# Altium project Wenzel_REF.PrjPCB (part 7 of 7)

## Sheet Wenzel_Arduino.SchDoc: =SheetTitle_Top
size 420 x 297 mm; EDA_Number: ARTIQ; Projet: Wenzel; Author: G.Kasprowicz; CompanyName: WUT ISE; DrawnBy: G.Kasprowicz; Organization: WUT ISE; Address1: PW ISE; Address2: Nowowiejska 15/19 00-665 Warsaw; Address3: gkasprow@gmail.com; Revision: 1.1; SheetNumber: -; SheetTotal: -; ModifiedBy: -; CheckedDate: -; Title2: Arduino; DivGrp: WUT ISE; Designer: G.Kasprowicz; ModifiedDate: -; ProjectName: Sensor Box
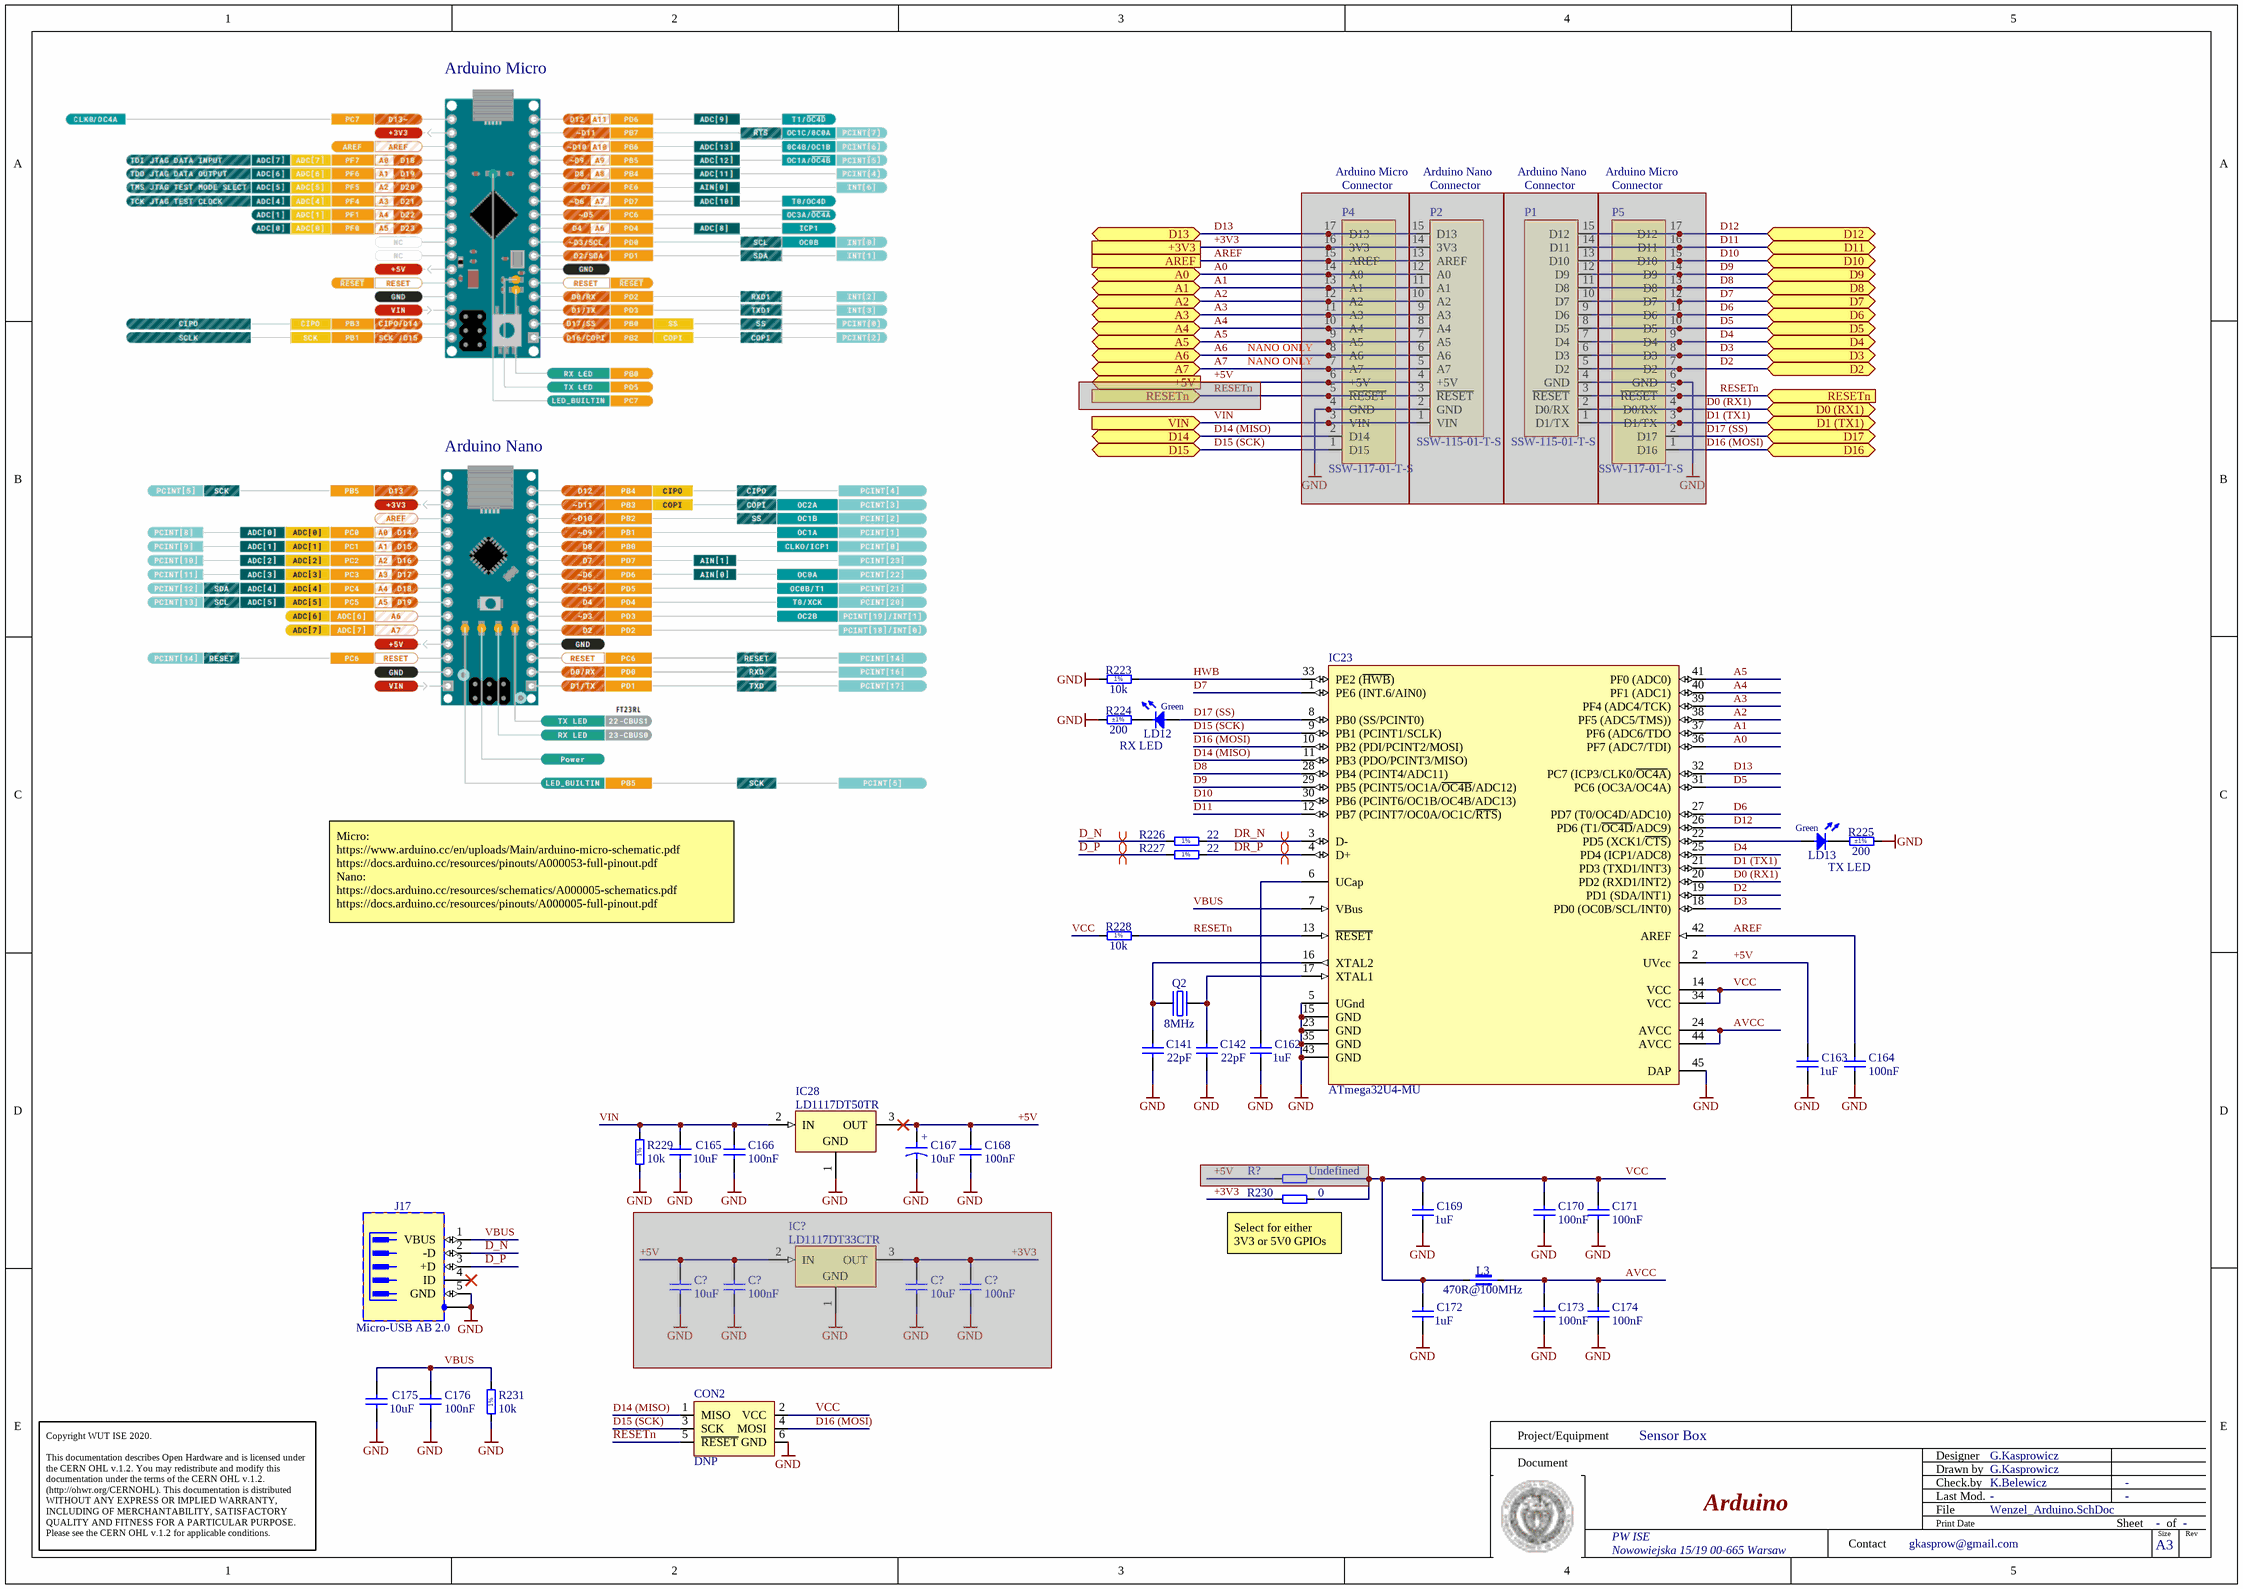
[diagram p10: Wenzel_Arduino.SchDoc]

### Parts
(Parts that share a designator on the sheet are numbered #1, #2 ... from top to bottom, then left to right.)
C141#2  22pF  [CAPC1005X55N]
C142#2  22pF  [CAPC1005X55N]
C162  1uF  [CAPC1005X55N]
C163  1uF  [CAPC1005X55N]
C164  100nF  [CAPC1005X55N]
C165  10uF  [CAPC1608X80N]
C166  100nF  [CAPC1005X55N]
C167  10uF  [CAPMP3216X180N]
C168  100nF  [CAPC1005X55N]
C169  1uF  [CAPC1005X55N]
C170  100nF  [CAPC1005X55N]
C171  100nF  [CAPC1005X55N]
C172  1uF  [CAPC1005X55N]
C173  100nF  [CAPC1005X55N]
C174  100nF  [CAPC1005X55N]
C175  10uF  [CAPC1608X80N]
C176  100nF  [CAPC1005X55N]
C?#5  100nF  [CAPC1608X87N]  (masked out: inside a compile mask, not in the netlist)
C?#6  100nF  [CAPC1608X87N]  (masked out: inside a compile mask, not in the netlist)
C?#7  10uF  [CAPC1608X80N]  (masked out: inside a compile mask, not in the netlist)
C?#8  10uF  [CAPC1608X80N]  (masked out: inside a compile mask, not in the netlist)
CON2  DNP  [HEADER3x2]
IC23#2  ATmega32U4-MU  [44PW_M]
IC28  LD1117DT50TR  [TO228P972X240-3N-R540X510]
IC?  LD1117DT33CTR  [TO228P972X240-3N-R540X510]  (masked out: inside a compile mask, not in the netlist)
J17  Micro-USB AB 2.0  [HIROSE_ZX62RD-AB-5P8]
L3#2  470R@100MHz  [INDC1608X95N]
LD12  Green  [LED_KINGBRIGHT_KPH-1608CGCK]
LD13  Green  [LED_KINGBRIGHT_KPH-1608CGCK]
P1  SSW-115-01-T-S  [SSW-115-01-T-S]  (masked out: inside a compile mask, not in the netlist)
P2  SSW-115-01-T-S  [SSW-115-01-T-S]  (masked out: inside a compile mask, not in the netlist)
P4  SSW-117-01-T-S  [SSW-117-01-T-S]  (masked out: inside a compile mask, not in the netlist)
P5  SSW-117-01-T-S  [SSW-117-01-T-S]  (masked out: inside a compile mask, not in the netlist)
Q2  8MHz  [XTAL_TXC_7A]
R223  10k  [RESC1608X55N]
R224  200  Tolerance: ±1%  [RESC1005X40N]
R225  200  Tolerance: ±1%  [RESC1005X40N]
R226  22  [RESC1005X40N]
R227  22  [RESC1005X40N]
R228  10k  [RESC1608X55N]
R229  10k  [RESC1608X55N]
R230  0  [RESC1005X40N]
R231  10k  [RESC1608X55N]
R?#4  Undefined  [RESC1005X40N]  (masked out: inside a compile mask, not in the netlist)

### Ports
+3V3, +5V (out), A0 (bidir), A1 (bidir), A2 (bidir), A3 (bidir), A4 (bidir), A5 (bidir), A6 (bidir), A7 (bidir), AREF, D0 (RX1) (bidir), D1 (TX1) (bidir), D2 (bidir), D3 (bidir), D4 (bidir), D5 (bidir), D6 (bidir), D7 (bidir), D8 (bidir), D9 (bidir), D10 (bidir), D11 (bidir), D12 (bidir), D13 (bidir), D14 (bidir), D15 (bidir), D16 (bidir), D17 (bidir), RESETn (in), VIN (in)

### Nets
+3V3: R230.2 ; port +3V3  [project net P3V3]
GND: C141#2.1 C142#2.1 C162.1 C163.1 C164.1 C165.1 C166.1 C167.2 C168.1 C169.1 C170.1 C171.1 C172.1 C173.1 C174.1 C175.1 C176.1 CON2.6(GND) IC23#2.5(UGnd) IC23#2.15(GND) IC23#2.23(GND) IC23#2.35(GND) IC23#2.43(GND) IC23#2.45(DAP) IC28.1(GND) J17.5(GND) J17.6(SH) R223.1 R224.1 R225.2 R229.1 R231.1
VIN: C165.2 C166.2 IC28.2(IN) R229.2 ; port VIN  [project net P12V0]
+5V: C163.2 C167.1 C168.2 IC23#2.2(UVcc) IC28.3(OUT)
A0: IC23#2.36(PF7_(ADC7/TDI)) ; port A0
A1: IC23#2.37(PF6_(ADC6/TDO) ; port A1
A2: IC23#2.38(PF5_(ADC5/TMS))) ; port A2
A3: IC23#2.39(PF4_(ADC4/TCK)) ; port A3
A4: IC23#2.40(PF1_(ADC1)) ; port A4
A5: IC23#2.41(PF0_(ADC0)) ; port A5
A6: port A6
A7: port A7
AREF: C164.2 IC23#2.42(AREF) ; port AREF
AVCC: C173.2 C174.2 IC23#2.24(AVCC) IC23#2.44(AVCC) L3#2.2
D0 (RX1): IC23#2.20(PD2_(RXD1/INT2))
D1 (TX1): IC23#2.21(PD3_(TXD1/INT3))
D2: IC23#2.19(PD1_(SDA/INT1)) ; port D2
D3: IC23#2.18(PD0_(OC0B/SCL/INT0)) ; port D3
D4: IC23#2.25(PD4_(ICP1/ADC8)) ; port D4
D5: IC23#2.31(PC6_(OC3A/OC4A)) ; port D5
D6: IC23#2.27(PD7_(T0/OC4D/ADC10)) ; port D6
D7: IC23#2.1(PE6_(INT.6/AIN0)) ; port D7
D8: IC23#2.28(PB4_(PCINT4/ADC11)) ; port D8
D9: IC23#2.29(PB5_(PCINT5/OC1A/~{OC4B}/ADC12)) ; port D9
D10: IC23#2.30(PB6_(PCINT6/OC1B/OC4B/ADC13)) ; port D10
D11: IC23#2.12(PB7_(PCINT7/OC0A/OC1C/~{RTS})) ; port D11
D12: IC23#2.26(PD6_(T1/~{OC4D}/ADC9)) ; port D12
D13: IC23#2.32(PC7_(ICP3/CLK0/~{OC4A})) ; port D13
D14 (MISO): CON2.1(MISO) IC23#2.11(PB3_(PDO/PCINT3/MISO)) ; port D14
D15 (SCK): CON2.3(SCK) IC23#2.9(PB1_(PCINT1/SCLK)) ; port D15
D16 (MOSI): CON2.4(MOSI) IC23#2.10(PB2_(PDI/PCINT2/MOSI))
D17 (SS): IC23#2.8(PB0_(SS/PCINT0)) LD12.2(A)
D_N: J17.2(-D) R226.1
D_P: J17.3(+D) R227.1
DR_N: IC23#2.3(D-) R226.2
DR_P: IC23#2.4(D+) R227.2
HWB: IC23#2.33(PE2_(~{HWB})) R223.2
RESETn: CON2.5(~{RESET}) IC23#2.13(~{RESET}) R228.2 ; port RESETn
VBUS: C175.2 C176.2 IC23#2.7(VBus) J17.1(VBUS) R231.2
VCC: C169.2 C170.2 C171.2 C172.2 CON2.2(VCC) IC23#2.14(VCC) IC23#2.34(VCC) L3#2.1 R228.1 R230.1
NetC141#2_2: C141#2.2 IC23#2.16(XTAL2) Q2.1(OSC1)
NetC142#2_2: C142#2.2 IC23#2.17(XTAL1) Q2.2(OSC2)
NetC162_2: C162.2 IC23#2.6(UCap)
NetIC23#2_22: IC23#2.22(PD5_(XCK1/~{CTS})) LD13.2(A)
NetLD12_1: LD12.1(C) R224.2
NetLD13_1: LD13.1(C) R225.1

Not connected (* = marked no-connect by the designer): J17 4(ID)*

### Layout directives
differential pair: D_N, D_P, DR_N, DR_P

### Notes on the sheet
- Arduino Micro
- Connector
- Arduino Nano
- (near P2) Connector
- (near P1) Connector
- (near P4) NANO ONLY
- RX LED
- Micro:
  https://www.arduino.cc/en/uploads/Main/arduino-micro-schematic.pdf
  https://docs.arduino.cc/resources/pinouts/A000053-full-pinout.pdf
  Nano:
  https://docs.arduino.cc/resources/schematics/A000005-schematics.pdf
  https://docs.arduino.cc/resources/pinouts/A000005-full-pinout.pdf
- TX LED
- (near R230) Select for either 3V3 or 5V0 GPIOs
- Project/Equipment
- Document
- Designer
- Drawn by
- Check.by
- Copyright WUT ISE 2020.
  This documentation describes Open Hardware and is licensed under the CERN OHL v.1.2. You may redistribute and modify this documentation under the terms of the CERN OHL v.1.2. (http://ohwr.org/CERNOHL). This documentation is distributed WITHOUT ANY EXPRESS OR IMPLIED WARRANTY, INCLUDING OF MERCHANTABILITY, SATISFACTORY QUALITY AND FITNESS FOR A PARTICULAR PURPOSE. Please see the CERN OHL v.1.2 for applicable conditions.
- Contact
- File
- Last Mod.
- Print Date
- Sheet
- Size
- A3
- of
- Rev
- (in symbol CTE3216-18_10UF_16V_20%_AVX_TCJ) +
- (in symbol R0402_22R_1%_0.0625W_100PPM) 1%
- (in symbol R0603_10K_1%_0.1W_100PPM) 1%

### Library data of the parts
C141#2 C142#2 = CC0402_22PF_50V_5%_C0G: Non-polarised capacitor; Part Description: SMD Multilayer Chip Ceramic Capacitor; Manufacturer: GENERIC; Manufacturer1 Part Number: C0402C220J5GACTU; Voltage: 50V; TC: C0G/NP0; Tolerance: ±5%; Part Number: CC0402_22PF_50V_5%_C0G; Component Kind: Standard; Component Type: Standard; Pin Count: 2; Value: 22pF; Status: Preferred; Manufacturer Part Number: CC0402_22PF_50V_5%_C0G; Case: 0402; Mounted: Yes; Socket: No; SMD: Yes; Manufacturer1 Example: KEMET; Manufacturer1 ComponentHeight: 0.55mm; HelpURL: \\cern.ch\dfs\Applications\Altium\Datasheets\CC0402_C0G_KEMET_(Commercial Grade).pdf; Author: CERN DEM JLC; CreateDate: 2007-12-03; LatestRevisionDate: 2007-12-03; Sense: No
C162 C163 C169 C172 = CC0402_1UF_16V_10%_X5R: Non-polarised capacitor; Part Description: SMD Multilayer Chip Ceramic Capacitor; Manufacturer: GENERIC; Manufacturer1 Part Number: C1005X5R1C105KT; Voltage: 16V; TC: X5R; Tolerance: ±10%; Part Number: CC0402_1UF_16V_10%_X5R; Component Kind: Standard; Component Type: Standard; Pin Count: 2; Value: 1uF; Status: Preferred; Manufacturer Part Number: CC0402_1UF_16V_10%_X5R; Case: 0402; Mounted: Yes; Socket: No; SMD: Yes; Sense: No; Manufacturer1 Example: TDK; Manufacturer1 ComponentHeight: 0.55mm; HelpURL: \\cern.ch\dfs\Applications\Altium\Datasheets\CC0402_X5R_TDK_C.pdf; Author: CERN DEM JLC; CreateDate: 2012-10-25; LatestRevisionDate: 2012-10-25
C164 C166 C168 C170 C171 C173 C174 C176 = CC0402_100NF_16V_10%_X5R: Non-polarised capacitor; Part Description: SMD Multilayer Chip Ceramic Capacitor; Manufacturer: GENERIC; Manufacturer1 Part Number: GRM155R61C104KA88D; Voltage: 16V; TC: X5R; Tolerance: ±10%; Part Number: CC0402_100NF_16V_10%_X5R; Component Kind: Standard; Component Type: Standard; Pin Count: 2; Value: 100nF; Status: None; Manufacturer Part Number: CC0402_100NF_16V_10%_X5R; Case: 0402; Mounted: Yes; Socket: No; SMD: Yes; Sense: No; Manufacturer1 Example: MURATA; Manufacturer1 ComponentHeight: 0.55mm; HelpURL: \\cern.ch\dfs\Applications\Altium\Datasheets\CC0402_X5R_MURATA_GRM.pdf; Author: CERN DEM JLC; CreateDate: 10.12.2013; LatestRevisionDate: 10.12.2013
C165 C175 = CC0603_10UF_16V_20%_X5R: Non-polarised capacitor; Part Description: SMD Multilayer Chip Ceramic Capacitor; Manufacturer: GENERIC; Manufacturer1 Part Number: GRM188R61C106MA73D; Voltage: 16V; TC: X5R; Tolerance: ±20%; Part Number: CC0603_10UF_16V_20%_X5R; Component Kind: Standard; Component Type: Standard; Pin Count: 2; Value: 10uF; Status: None; Manufacturer Part Number: CC0603_10UF_16V_20%_X5R; Case: 0603; Mounted: Yes; Socket: No; SMD: Yes; Sense: No; Manufacturer1 Example: MURATA; Manufacturer1 ComponentHeight: 0.8mm; HelpURL: \\cern.ch\dfs\Applications\Altium\Datasheets\CC0603_X5R_MURATA_GRM.pdf; Author: CERN DEM MR; CreateDate: 02.03.2016; LatestRevisionDate: 02.03.2016
C167 = CTE3216-18_10UF_16V_20%_AVX_TCJ: Polarised capacitor; Part Description: ESR 0R200 Tantalum Solid Electrolytic Chip Capacitor with Conductive Polymer Electrode; Manufacturer: AVX; Manufacturer Part Number: TCJA106M016R0200 or  or TR3A106K016C1700; Voltage: 16V; Tolerance: ±20%; Part Number: CTE3216-18_10UF_16V_20%_AVX_TCJ; Component Kind: Standard; Component Type: Standard; Pin Count: 2; Value: 10uF; Status: Preferred; Case: A; Mounted: Yes; Socket: No; SMD: Yes; Sense: No; HelpURL: \\cern.ch\dfs\Applications\Altium\Datasheets\CTE_AVX_TCJ.pdf; Author: CERN DEM JLC; CreateDate: 29.03.2012; LatestRevisionDate: 29.03.2012; ComponentHeight: 1.8mm
C?#5 C?#6 = CC0603_100NF_50V_10%_X5R: Non-polarised capacitor; Part Description: SMD Multilayer Chip Ceramic Capacitor; Manufacturer: GENERIC; Manufacturer1 Part Number: C1608X5R1H104K080AA; Voltage: 50V; TC: X5R; Tolerance: ±10%; Part Number: CC0603_100NF_50V_10%_X5R; Component Kind: Standard; Component Type: Standard; Pin Count: 2; Value: 100nF; Status: None; Manufacturer Part Number: CC0603_100NF_50V_10%_X5R; Case: 0603; Mounted: Yes; Socket: No; SMD: Yes; Sense: No; Manufacturer1 Example: TDK; Manufacturer1 ComponentHeight: 0.9mm; HelpURL: \\cern.ch\dfs\Applications\Altium\Datasheets\CC0603_X5R_TDK_C.pdf; Author: CERN DEM MR; CreateDate: 08.01.2016; LatestRevisionDate: 08.01.2016
C?#7 C?#8 = CC0603_10UF_10V_10%_X5R: Non-polarised capacitor; Part Description: SMD Multilayer Chip Ceramic Capacitor; Manufacturer: GENERIC; Manufacturer1 Part Number: GRM188R61A106KE69D; Voltage: 10V; TC: X5R; Tolerance: ±10%; Part Number: CC0603_10UF_10V_10%_X5R; Component Kind: Standard; Component Type: Standard; Pin Count: 2; Value: 10uF; Status: None; Manufacturer Part Number: CC0603_10UF_10V_10%_X5R; Case: 0603; Mounted: Yes; Socket: No; SMD: Yes; Sense: No; Manufacturer1 Example: MURATA; Manufacturer1 ComponentHeight: 0.8mm; HelpURL: \\cern.ch\dfs\Applications\Altium\Datasheets\CC0603_MURATA_GRM188R61A106KE69D.pdf; Author: CERN DEM JLC; CreateDate: 31.01.2017; LatestRevisionDate: 31.01.2017
CON2 = CON_ISP: 6x 2.54mm SMT  dual row pin header
IC23#2 = CMP-0095-00166-2: 8-bit AVR Microcontroller, 2.7-5.5V, 16MHz, 32KB Flash, 1KB EEPROM, 2.5KB SRAM, USB Controller, 44-pin QFN, Industrial Grade (-40°C to 85°C), Ext Osc; Manufacturer: Microchip; PackageVersion: revG, Sep-2009; PackageReference: 44PW; ComponentLink1URL: http://www.atmel.com/; PackageDescription: 44-Pin Quad Flat No-Lead Package, 7 x 7 mm Body, 0.5 mm Pitch (QFN); ComponentLink3Description: ATmega16U4 ATmega32U4 Summary; RevisionNote: DatasheetVersion, PackageVersion & PCB updated. URLs added.; ComponentLink2Description: ATmega16U4/32U4 Datasheet; ComponentLink1Description: Manufacturer URL; ComponentLink3URL: http://www.atmel.com/dyn/resources/prod_documents/7766S.pdf; DatasheetVersion: revF, Nov-2010; ComponentLink2URL: http://www.atmel.com/dyn/resources/prod_documents/doc7766.pdf; Code_JEDEC: MO-220-VKKD-1; Part Number: ATmega32U4-MU; Manufacturer Part Number: ATmega32U4-MU
IC28 = LD1117DT50TR: 3-Terminal Regulator 1=GND 2=IN 3=OUT; Part Description: 5V 800mA Low drop fixed positive voltage regulators; Manufacturer: ST MICROELECTRONICS; PressFit: No; Bonding: No; Part Number: LD1117DT50TR; Component Kind: Standard; Component Type: Standard; Device: LD1117DT50TR; PackageDescription: TO-252 DPAK TO, 2.28mm Pitch; 2 Pin, 9.725mm L X 6.10mm W X 2.40mm H body, IPC Medium Density; Manufacturer Part Number: LD1117DT50TR; Pin Count: 3; Case: DPAK; Mounted: Yes; Socket: No; SMD: Yes; Sense: No; ComponentHeight: 2.4mm; HelpURL: \\cern.ch\dfs\Applications\Altium\Datasheets\LD1117DT50TR.pdf; Author: CERN DEM JLC; CreateDate: 20/09/2010; LatestRevisionDate: 20/09/2010
IC? = LD1117DT33CTR: 3-Terminal Regulator 1=GND 2=IN 3=OUT; Part Description: 3.3V 800mA Low drop fixed and adjustable positive voltage regulators; Manufacturer: ST MICROELECTRONICS; PressFit: No; Bonding: No; Part Number: LD1117DT33CTR; Component Kind: Standard; Component Type: Standard; Device: LD1117DT33CTR; PackageDescription: DPAK TO-252, 2.28mm pitch; 2 pin, 9.725mm L X 6.10mm W X 2.40mm H body, IPC Medium Density; Manufacturer Part Number: LD1117DT33CTR; Pin Count: 3; Case: DPAK; Mounted: Yes; Socket: No; SMD: Yes; Sense: No; ComponentHeight: 2.4mm; HelpURL: \\cern.ch\dfs\Applications\Altium\Datasheets\LD1117DT33CTR.pdf; Author: CERN DEM JLC; CreateDate: 08.06.2011; LatestRevisionDate: 08.06.2011
J17 = HIROSE_ZX62RD-AB-5P8: 5 Pin + 1 Shield USB Receptacle; Part Description: Micro-USB 2.0 Right Angle, SMD Type AB - Reverse (Top mount), Shell Through Hole; Manufacturer: HIROSE (HRS); PressFit: No; Part Number: HIROSE_ZX62RD-AB-5P8; Component Kind: Standard; Component Type: Standard; Pin Count: 7; Family: Micro-USB AB 2.0; Mounted: Yes; Socket: No; SMD: Yes; Sense: No; Status: None; Manufacturer Part Number: ZX62RD-AB-5P8; ComponentHeight: 2.35mm; HelpURL: \\cern.ch\dfs\Applications\Altium\Datasheets\HIROSE_ZX62RD-AB-5P8.pdf; ComponentLink1URL: \\cern.ch\dfs\Applications\Altium\Datasheets\HIROSE_ZX62RD-AB-5P8_Package-Drawing.pdf; ComponentLink1Description: Package-Drawing; Author: CERN DEM JLC; CreateDate: 29.10.2014; LatestRevisionDate: 29.10.2014; ClassName: Connectors
L3#2 = IND0603_MURATA_BLM18PG471SN1D: Part Description: SMD EMIFIL Chip Ferrite Bead; Manufacturer: MURATA; Power: 1A; Resistance: 0.2R; Tolerance: ±25%; Part Number: IND0603_MURATA_BLM18PG471SN1D; Component Kind: Standard; Component Type: Standard; Pin Count: 2; Value: 470R@100MHz; Manufacturer Part Number: BLM18PG471SN1D; Case: 0603; Mounted: Yes; Socket: No; SMD: Yes; Sense: No; ComponentHeight: 0.95mm; HelpURL: \\cern.ch\dfs\Applications\Altium\Datasheets\IND0603_MURATA_BLM18P.pdf; Author: CERN DEM BC; CreateDate: 17.02.2021; LatestRevisionDate: 17.02.2021
LD12 LD13 = LED_KINGBRIGHT_KPH-1608CGCK: LED Green 1C 2A; Part Description: SMD Green LED, Case 1.6mmX0.8mm(0603), 0.65mm Thickness; PressFit: No; Bonding: No; Part Number: LED_KINGBRIGHT_KPH-1608CGCK; Component Kind: Standard; Component Type: Standard; Color: Green; PackageDescription: SMT Green LED, Case 0603, Body L 1.6 x W 0.8mm H 0.65mm; Manufacturer: KINGBRIGHT; Manufacturer Part Number: KPH-1608CGCK; Pin Count: 2; Mounted: Yes; Socket: No; SMD: Yes; Sense: No; ComponentHeight: 0.65mm; HelpURL: \\cern.ch\dfs\Applications\Altium\Datasheets\LED_KINGBRIGHT_KPH-1608CGCK.pdf; Author: CERN DEM JLC; CreateDate: 03.07.2017; LatestRevisionDate: 03.07.2017
P1 = Arduino_Nano_Socket_A: Manufacturer1: Samtec; Part Number: SSW-115-01-T-S; Manufacturer1 Part Number: SSW-115-01-T-S
P2 = Arduino_Nano_Socket_B: Manufacturer1: Samtec; Part Number: SSW-115-01-T-S; Manufacturer1 Part Number: SSW-115-01-T-S
P4 = Arduino_Micro_Socket_B: Manufacturer1: Samtec; Part Number: SSW-117-01-T-S; Manufacturer1 Part Number: SSW-117-01-T-S
P5 = Arduino_Micro_Socket_A: Manufacturer1: Samtec; Part Number: SSW-117-01-T-S; Manufacturer1 Part Number: SSW-117-01-T-S
Q2 = XTAL_8MHZ_TXC_7A-8.000MAAE-T: Quartz Crystal; Part Description: Tolerance: ±30ppm, Stability: ±30ppm, -20°C to +70°C, 12pF, SMD Glass Seam Sealing Crystal, 7A Series; Manufacturer: TXC CORPORATION; PressFit: No; Bonding: No; Part Number: XTAL_8MHZ_TXC_7A-8.000MAAE-T; Component Kind: Standard; Component Type: Standard; PackageDescription: 2 Pins, 3.2x5mm, SMD Glass Seam Sealing Crystal, 7A Serie; Value: 8MHz; Manufacturer Part Number: 7A-8.000MAAE-T; Pin Count: 2; Mounted: Yes; Socket: No; SMD: Yes; Sense: No; ComponentHeight: 1.2mm; HelpURL: \\cern.ch\dfs\Applications\Altium\Datasheets\XTAL_TXC_7A.pdf; Author: CERN DEM JLC; CreateDate: 09.10.2014; LatestRevisionDate: 12.11.2014
R223 R228 R229 R231 = R0603_10K_1%_0.1W_100PPM: Resistor - 1%; Part Description: General Purpose Thick Film Chip Resistor; Manufacturer: GENERIC; Manufacturer1 Part Number: NRC06F1002TRF; Power: 0.1W; TC: ±100ppm/°C; PressFit: No; Part Number: R0603_10K_1%_0.1W_100PPM; Component Kind: Standard; Component Type: Standard; Pin Count: 2; Value: 10k; Status: Preferred; Tolerance: ±1%; Manufacturer Part Number: R0603_10K_1%_0.1W_100PPM; Case: 0603; Mounted: Yes; Sense: No; Socket: No; SMD: Yes; Manufacturer1 Example: NIC COMPONENT; Manufacturer1 ComponentHeight: 0.55mm; HelpURL: \\cern.ch\dfs\Applications\Altium\Datasheets\R0603_NIC_NRC.pdf; Author: CERN DEM JLC; CreateDate: 03.12.2007; LatestRevisionDate: 13.03.2008
R224 R225 = R0402_200R_1%_0.0625W_100PPM: Resistor - 1%; Part Description: General Purpose Thick Film Chip Resistor; Manufacturer: GENERIC; Manufacturer1 Part Number: 232270672001L; TC: ±100ppm/°C; PressFit: No; Part Number: R0402_200R_1%_0.0625W_100PPM; Component Kind: Standard; Component Type: Standard; Pin Count: 2; Value: 200; Status: Not Recommended; Power: 0.0625W; Manufacturer Part Number: R0402_200R_1%_0.0625W_100PPM; Case: 0402; Mounted: Yes; Sense: No; Socket: No; SMD: Yes; Manufacturer1 Example: YAGEO PHYCOMP; Manufacturer1 ComponentHeight: 0.4mm; HelpURL: \\cern.ch\dfs\Applications\Altium\Datasheets\R0402_Phycomp_RC0402.pdf; Author: CERN DEM JLC; CreateDate: 03.12.2007; LatestRevisionDate: 17.10.2012
R226 R227 = R0402_22R_1%_0.0625W_100PPM: Resistor - 1%; Part Description: General Purpose Thick Film Chip Resistor; Manufacturer: GENERIC; Manufacturer1 Part Number: 232270672209L; PressFit: No; Part Number: R0402_22R_1%_0.0625W_100PPM; Component Kind: Standard; Component Type: Standard; Pin Count: 2; Value: 22; Status: Not Recommended; Power: 0.0625W; Tolerance: ±1%; Manufacturer Part Number: R0402_22R_1%_0.0625W_100PPM; Case: 0402; Mounted: Yes; Socket: No; SMD: Yes; Manufacturer1 Example: YAGEO PHYCOMP; Manufacturer1 ComponentHeight: 0.4mm; HelpURL: \\cern.ch\dfs\Applications\Altium\Datasheets\R0402_Phycomp_RC0402.pdf; Author: CERN DEM JLC; CreateDate: 03.12.2007; LatestRevisionDate: 17.10.2012; Sense: No
R230 = R0402_0R_JUMPER: Resistor; Part Description: 1A (0.05R Max DC Resistance) Zero Ohm Jumper; Manufacturer: GENERIC; Manufacturer1 Part Number: 232270591001L; PressFit: No; Part Number: R0402_0R_JUMPER; Component Kind: Standard; Component Type: Standard; Pin Count: 2; Value: 0; Status: Not Recommended; Manufacturer Part Number: R0402_0R_JUMPER; Case: 0402; Mounted: Yes; Socket: No; SMD: Yes; Manufacturer1 Example: YAGEO PHYCOMP; Manufacturer1 ComponentHeight: 0.4mm; HelpURL: \\cern.ch\dfs\Applications\Altium\Datasheets\R0402_Phycomp_RC0402.pdf; Author: CERN DEM JLC; CreateDate: 03.12.2007; LatestRevisionDate: 17.10.2012; Sense: No
R?#4 = R0402_NO-VALUE: Resistor; Part Description: Reserved Footprint For a 0402 (1005) Chip Resistor; Mounted: No; Part Number: R0402_NO-VALUE; Component Kind: Standard; Component Type: Standard; Pin Count: 2; Value: Undefined; Status: None; Manufacturer: Undefined; Manufacturer Part Number: R0402_NO-VALUE; Case: 0402; Sense: No; Socket: No; SMD: Yes; Manufacturer1 Example: Undefined; Manufacturer1 Part Number: Undefined; Manufacturer1 ComponentHeight: Undefined; HelpURL: Undefined; Author: CERN DEM JLC; CreateDate: 03.12.2007; LatestRevisionDate: 13.03.2008

## Nets that join several sheets
GND: Wenzel_REF (54 pins), Drivers (13 pins), Clock_fanout (19 pins), Clock_Generator_Divider (42 pins), Shield_Connectors (17 pins), ETH_PHY (64 pins), Power_Supply (111 pins), CPCIS_Connectors (37 pins), EEM_Connectors (38 pins), PLL (30 pins), Wenzel_Arduino (32 pins)
P3V3: Wenzel_REF (LD5.2 LD9.2), Drivers (10 pins), ETH_PHY (R192.1 R193.1), Power_Supply (6 pins), EEM_Connectors (C298.2 IC40.14), PLL (C158.2 L10.1), Wenzel_Arduino (R230.2)
P3V3_DIOT: Power_Supply (6 pins), CPCIS_Connectors (13 pins)
P3V3_MP: Power_Supply (11 pins), EEM_Connectors (C219.2 IC25.8 IC42.4 J8.30)
P3V3A: Wenzel_REF (LD6.2), Clock_fanout (L9.1), Clock_Generator_Divider (7 pins), Power_Supply (8 pins), PLL (C155.2 L7.1)
P5V0_VREF: Power_Supply (7 pins), PLL (R159.2 R160.2)
P5V4A: Power_Supply (11 pins), PLL (C151.2 L5.1)
P10V5A: Power_Supply (8 pins), PLL (L14.1)
P12V0: Shield_Connectors (J14.23 J14.24 J14.25), ETH_PHY (6 pins), Power_Supply (8 pins), EEM_Connectors (8 pins), Wenzel_Arduino (C165.2 C166.2 IC28.2 R229.2)
P12V0_DIOT: Power_Supply (C134.2 IC2.1 IC2.3), CPCIS_Connectors (7 pins), EEM_Connectors (R163.1 R164.1 R165.1 R166.1)
VCC_OSC: Clock_Generator_Divider (L11.1), Power_Supply (R6.2 R24.2 R28.2 TP9.1)
10MHz: Wenzel_REF (R15.2), Shield_Connectors (C138.1)
10MHz_Ref: Wenzel_REF (C140#1.1 R15.1), PLL (R157#2.1)
A2: Drivers (R36.1 R221.2 T7.1), Shield_Connectors (R183.2), ETH_PHY (IC20.19 R191.1), Wenzel_Arduino (IC23#2.38)
A4: Wenzel_REF (R13.2), Wenzel_Arduino (IC23#2.40)
A5: Wenzel_REF (R12.2), Wenzel_Arduino (IC23#2.41)
BP_I2C.SCL: CPCIS_Connectors (D5.3 J6.B2), EEM_Connectors (R53.1)
BP_I2C.SDA: CPCIS_Connectors (D5.1 J6.C2), EEM_Connectors (R52.1)
BP_IO.LVDS_N0: CPCIS_Connectors (J6.E3), EEM_Connectors (R144.1)
BP_IO.LVDS_N1: CPCIS_Connectors (J6.B3), EEM_Connectors (R145.1)
BP_IO.LVDS_N2: CPCIS_Connectors (J6.C4), EEM_Connectors (R146.1)
BP_IO.LVDS_N3: CPCIS_Connectors (J6.L4), EEM_Connectors (R147.1)
BP_IO.LVDS_N4: CPCIS_Connectors (J6.I4), EEM_Connectors (R149.1)
BP_IO.LVDS_N5: CPCIS_Connectors (J6.K5), EEM_Connectors (R150.1)
BP_IO.LVDS_N6: CPCIS_Connectors (J6.H5), EEM_Connectors (R151.1)
BP_IO.LVDS_N7: CPCIS_Connectors (J6.F6), EEM_Connectors (R152.1)
BP_IO.LVDS_P0: CPCIS_Connectors (J6.D3), EEM_Connectors (R54.1)
BP_IO.LVDS_P1: CPCIS_Connectors (J6.A3), EEM_Connectors (R55.1)
BP_IO.LVDS_P2: CPCIS_Connectors (J6.B4), EEM_Connectors (R57.1)
BP_IO.LVDS_P3: CPCIS_Connectors (J6.K4), EEM_Connectors (R58.1)
BP_IO.LVDS_P4: CPCIS_Connectors (J6.H4), EEM_Connectors (R59.1)
BP_IO.LVDS_P5: CPCIS_Connectors (J6.J5), EEM_Connectors (R60.1)
BP_IO.LVDS_P6: CPCIS_Connectors (J6.G5), EEM_Connectors (R61.1)
BP_IO.LVDS_P7: CPCIS_Connectors (J6.E6), EEM_Connectors (R62.1)
BP_MGT.Rx_N: ETH_PHY (IC12.17), CPCIS_Connectors (R11.1)
BP_MGT.Rx_P: ETH_PHY (IC12.16), CPCIS_Connectors (R10.1)
BP_MGT.Tx_N: ETH_PHY (IC12.14), CPCIS_Connectors (R246.1)
BP_MGT.Tx_P: ETH_PHY (IC12.15), CPCIS_Connectors (R245.1)
D2: Clock_Generator_Divider (IC17.5), Wenzel_Arduino (IC23#2.19)
D3: Wenzel_REF (R92.2), Drivers (R34.1), Clock_Generator_Divider (IC18.1 R82.2 R113.2), Shield_Connectors (R222.2), Wenzel_Arduino (IC23#2.18)
D4: Wenzel_REF (T6.1), Drivers (R118#1.1), Shield_Connectors (R123#1.2), PLL (C161.1 R211#2.2), Wenzel_Arduino (IC23#2.25)
D8: Shield_Connectors (R233.1), Wenzel_Arduino (IC23#2.28)
D9: Shield_Connectors (R236.1), Wenzel_Arduino (IC23#2.29)
D10: Shield_Connectors (R237.1), Wenzel_Arduino (IC23#2.30)
D11: PLL (R208#2.1), Wenzel_Arduino (IC23#2.12)
D14 (MISO): Wenzel_REF (R72#1.1), Wenzel_Arduino (CON2.1 IC23#2.11)
D15 (SCK): PLL (R161#2.1), Wenzel_Arduino (CON2.3 IC23#2.9)
DELAY_Q1_N: Shield_Connectors (J15.24), EEM_Connectors (J9.3)
DELAY_Q1_P: Shield_Connectors (J15.23), EEM_Connectors (J9.2)
EEM0_I2C.SCL: Power_Supply (R128.1), EEM_Connectors (6 pins)
EEM0_I2C.SDA: Power_Supply (R126.1), EEM_Connectors (6 pins)
EEM_IO.LVDS_N0: Clock_Generator_Divider (R76.2), EEM_Connectors (J8.3 R144.2)
EEM_IO.LVDS_N1: Drivers (IC24.7), EEM_Connectors (J8.6 R145.2)
EEM_IO.LVDS_N2: Drivers (IC10.7), EEM_Connectors (J8.9 R146.2)
EEM_IO.LVDS_N3: Drivers (IC5.1 R16.1), EEM_Connectors (J8.12 R147.2)
EEM_IO.LVDS_N4: Drivers (IC10.5), EEM_Connectors (J8.15 R149.2)
EEM_IO.LVDS_N5: Drivers (IC5.4 R18.2), EEM_Connectors (J8.18 R150.2)
EEM_IO.LVDS_N6: Drivers (IC11.7), EEM_Connectors (J8.21 R151.2)
EEM_IO.LVDS_N7: Drivers (IC11.5), EEM_Connectors (J8.24 R152.2)
EEM_IO.LVDS_P0: Clock_Generator_Divider (R78.2), EEM_Connectors (J8.2 R54.2)
EEM_IO.LVDS_P1: Drivers (IC24.8), EEM_Connectors (J8.5 R55.2)
EEM_IO.LVDS_P2: Drivers (IC10.8), EEM_Connectors (J8.8 R57.2)
EEM_IO.LVDS_P3: Drivers (IC5.2 R16.2), EEM_Connectors (J8.11 R58.2)
EEM_IO.LVDS_P4: Drivers (IC10.6), EEM_Connectors (J8.14 R59.2)
EEM_IO.LVDS_P5: Drivers (IC5.3 R18.1), EEM_Connectors (J8.17 R60.2)
EEM_IO.LVDS_P6: Drivers (IC11.8), EEM_Connectors (J8.20 R61.2)
EEM_IO.LVDS_P7: Drivers (IC11.6), EEM_Connectors (J8.23 R62.2)
IN_CLK0_N: Clock_fanout (C15.1), Clock_Generator_Divider (IC17.27 R73.2)
IN_CLK0_P: Clock_fanout (C9.1), Clock_Generator_Divider (IC17.28 R74.1)
MDC: Shield_Connectors (R176.2), ETH_PHY (IC12.42)
MDIO: Shield_Connectors (R175.2), ETH_PHY (IC12.41)
NetIC20_3: Wenzel_REF (R13.1), ETH_PHY (IC20.3 R192.2 TP5.1)
NetIC20_4: Wenzel_REF (R12.1), ETH_PHY (IC20.4 R193.2 TP6.1)
NetIC40_9: Drivers (IC40.9), Shield_Connectors (R171.2)
NetR14_1: Drivers (R14.1 R172.2), Shield_Connectors (R170.2)
PGOOD: Wenzel_REF (T13.1), Power_Supply (9 pins), CPCIS_Connectors (R218.1 T2.1)
PHY_RSTn: Shield_Connectors (R174.2), ETH_PHY (IC12.43)
PSU_EN: Power_Supply (6 pins), CPCIS_Connectors (R204.1)
RF_100M: Clock_Generator_Divider (R216#1.2), PLL (C144.1 R212#2.2)
RF_100M_OUT0: Wenzel_REF (J2.1), Clock_Generator_Divider (IC16.6)
RF_100M_OUT1: Wenzel_REF (J3.1), Clock_Generator_Divider (IC16.7)
RF_100M_OUT2: Wenzel_REF (J4.1), Clock_Generator_Divider (IC16.9)
RF_DIV5_GND: Wenzel_REF (J7#1.2), Clock_Generator_Divider (TR5.6)
RF_DIV5_OUT: Wenzel_REF (J7#1.1), Clock_Generator_Divider (TR5.4)
RF_DIV_OUT0: Wenzel_REF (J10.1), Clock_fanout (TR1.4)
RF_DIV_OUT1: Wenzel_REF (J11.1), Clock_fanout (TR2.4)
RF_DIV_OUT2: Wenzel_REF (J12.1), Clock_fanout (TR3.4)
RF_DIV_OUT3: Wenzel_REF (J13.1), Clock_fanout (TR4.4)
RF_GND_OUT0: Wenzel_REF (J10.2), Clock_fanout (TR1.6)
RF_GND_OUT1: Wenzel_REF (J11.2), Clock_fanout (TR2.6)
RF_GND_OUT2: Wenzel_REF (J12.2), Clock_fanout (TR3.6)
RF_GND_OUT3: Wenzel_REF (J13.2), Clock_fanout (TR4.6)
RGMII_RX_CLK: Shield_Connectors (J14.3), ETH_PHY (IC12.32)
RGMII_RX_CTRL: Shield_Connectors (J14.2), ETH_PHY (IC12.38)
RGMII_RXD0: Shield_Connectors (J14.5), ETH_PHY (IC12.33)
RGMII_RXD1: Shield_Connectors (J14.6), ETH_PHY (IC12.34)
RGMII_RXD2: Shield_Connectors (J14.7), ETH_PHY (IC12.35)
RGMII_RXD3: Shield_Connectors (J14.8), ETH_PHY (IC12.36)
RGMII_TX_CLK: Shield_Connectors (R177.2), ETH_PHY (IC12.29)
RGMII_TX_CTRL: Shield_Connectors (R178.2), ETH_PHY (IC12.37)
RGMII_TXD0: Shield_Connectors (R179.2), ETH_PHY (IC12.28)
RGMII_TXD1: Shield_Connectors (R180.2), ETH_PHY (IC12.27)
RGMII_TXD2: Shield_Connectors (R181.2), ETH_PHY (IC12.26)
RGMII_TXD3: Shield_Connectors (R182.2), ETH_PHY (IC12.25)
SERVMOD_3V3: CPCIS_Connectors (R44.2 R138.1), EEM_Connectors (IC40.5 IC40.13)
VCO_IN: Wenzel_REF (R168.1), Clock_Generator_Divider (OSC1.3), PLL (R2.2)
VCO_REF_IN: Clock_Generator_Divider (OSC1.4), PLL (R148.2)

## Assembly variants
Pletronics: not fitted C64 C66 C140 CON2 IC4 IC42 IC43 J5 R76 R78 R83 R84 R86 R87 R89 R90 R91 R94 R95 R97 R98 R102 R103 R104 R106 R108 R109 R110 R112 R115 R120 R132 R134 R168 R234 R235; alternate parts R167 -> R0603_0R_JUMPER